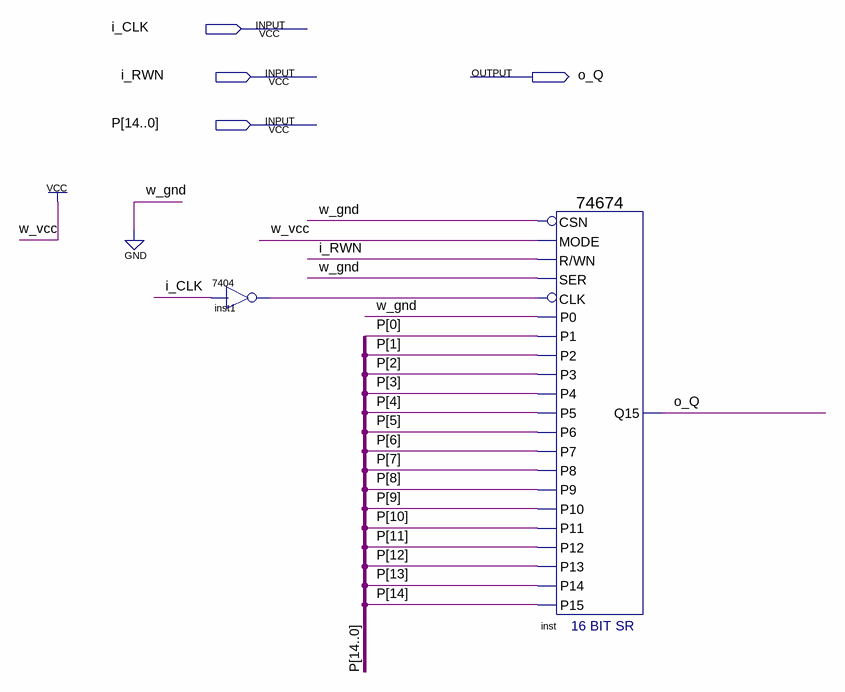
[diagram p0: schematic sheet]
// Quartus schematic ttl74674.bdf as structural Verilog: 2 symbols, 4 pins
module ttl74674 (
  input  i_CLK,
  input  i_RWN,
  input  [14:0] P,
  output o_Q
);

  wire inst1_1;

  \7404  inst1 (.\2 (i_CLK), .\1 (inst1_1));
  \74674  inst (
    .P0(1'b0), .P1(P[0]), .P2(P[1]), .P3(P[2]), .P5(P[4]), .P4(P[3]), .P6(P[5]), .P7(P[6]), .P10(P[9]),
    .P9(P[8]), .P8(P[7]), .P13(P[12]), .P12(P[11]), .P11(P[10]), .CSN(1'b0), .P15(P[14]), .P14(P[13]),
    .\R/WN (i_RWN), .CLK(inst1_1), .MODE(1'b1), .SER(1'b0), .Q15(o_Q));
endmodule
